# EAGLE design PingPong_388_2019 rev2 (EAGLE 9.5.1)
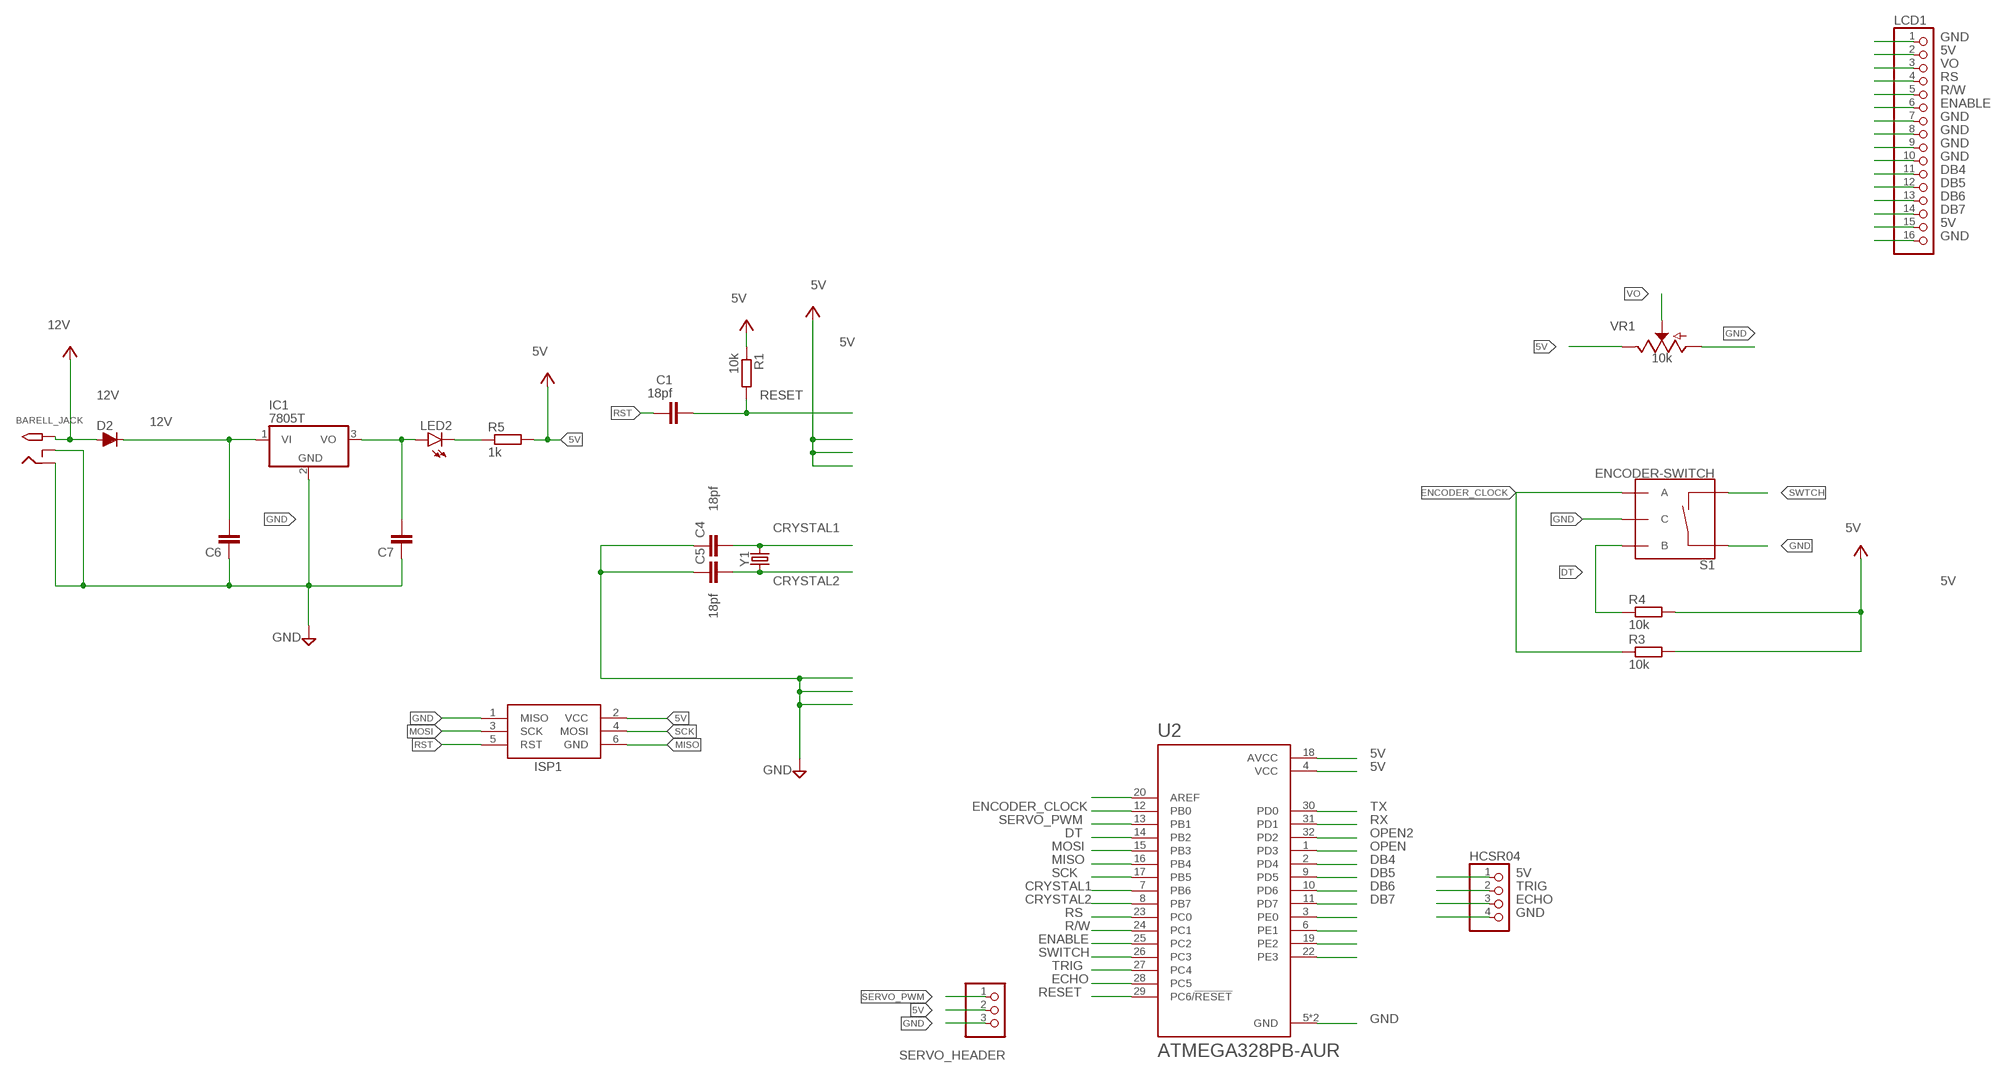
[diagram p0: schematic, sheet 1]

## Parts
BARELL_JACK  2.1MMJACKTHM  [PJ-102A]
C1  18pf  C-EUC0805  [C0805]
C4  18pf  C-EUC0805  [C0805]
C5  18pf  C-EUC0805  [C0805]
C6  C-EUC0805  [C0805]
C7  C-EUC0805  [C0805]
D2  D-FILL-MLL-34  [MELF-MLL34]
HCSR04  PINHD-1X4  [1X04]
IC1  7805T  [TO220H]
ISP1  AVRISP-6  [AVRISP]
LCD1  PINHD-1X16  [1X16]
LED2  LED  [SMARTLED-TTW]
R1  10k  R-EU_R0805  [R0805]
R3  10k  R-EU_R0805  [R0805]
R4  10k  R-EU_R0805  [R0805]
R5  1k  R-EU_R0805  [R0805]
S1  ENCODER-SWITCH  [ROTARY_ENC_PLAIN]
SERVO_HEADER  PINHD-1X3  [1X03]
U2  ATMEGA328PB-AUR  [QFP80P900X900X120-32N]
VR1  10k  POTENTIOMETER-PTH-9MM-1/20W-20%  [POT-PTH-ALPS]
Y1  CRYSTALSMD-HC49UP  [HC49UP]

## Nets
5V: C7.2 HCSR04.1 IC1.3(VO) ISP1.2(VCC) LCD1.2 LCD1.15 LED2.A@1(A) R3.2 R4.2 R5.2 SERVO_HEADER.2 U2.4(VCC) U2.18(AVCC) VR1.P$1(E)
12V: BARELL_JACK.TIP C6.2 D2.1(C) D2.2(A) IC1.1(VI)
CRYSTAL1: C4.2 U2.7(PB6) Y1.2
CRYSTAL2: C5.2 U2.8(PB7) Y1.1
DB4: LCD1.11 U2.2(PD4)
DB5: LCD1.12 U2.9(PD5)
DB6: LCD1.13 U2.10(PD6)
DB7: LCD1.14 U2.11(PD7)
DT: R4.1 S1.B U2.14(PB2)
ECHO: HCSR04.3 U2.28(PC5)
ENABLE: LCD1.6 U2.25(PC2)
ENCODER_CLOCK: R3.1 S1.A U2.12(PB0)
GND: BARELL_JACK.RING BARELL_JACK.RING_SW C4.1 C5.1 C6.1 C7.1 HCSR04.4 IC1.2(GND) ISP1.1(MISO) LCD1.1 LCD1.7 LCD1.8 LCD1.9 LCD1.10 LCD1.16 S1.C S1.SW+ SERVO_HEADER.3 U2.5(GND) U2.21(GND) VR1.P$3(A)
MISO: ISP1.6(GND) U2.16(PB4)
MOSI: ISP1.3(SCK) U2.15(PB3)
N$3: LED2.C@1(C) R5.1
N$14: U2.3(PE0)
N$15: U2.6(PE1)
N$16: U2.19(PE2)
N$17: U2.22(PE3)
N$18: U2.20(AREF)
OPEN: U2.1(PD3)
OPEN2: U2.32(PD2)
R/W: LCD1.5 U2.24(PC1)
RESET: C1.2 R1.2 U2.29(PC6/!RESET)
RS: LCD1.4 U2.23(PC0)
RST: C1.1 ISP1.5(RST)
RX: U2.31(PD1)
SCK: ISP1.4(MOSI) U2.17(PB5)
SERVO_PWM: SERVO_HEADER.1 U2.13(PB1)
SWITCH: U2.26(PC3)
SWTCH: S1.SW-
TRIG: HCSR04.2 U2.27(PC4)
TX: U2.30(PD0)
VCC: R1.1 ; supply symbol labelled 5V
VO: LCD1.3 VR1.P$2(S)

## Library data of the parts
BARELL_JACK = ECE388:2.1MMJACK: 2.1mm x 5.5mm THM DC jack with internal switch. Digikey part #PJ-102A, 4UCON part #05537 2.1mm x 5.5mm SMT DC jack with internal switch. Digikey part #PJ-002A-SMT, 4UCON part #03267 By microbuilder.eu & adafruit.com
C1 C4-C7 = rcl:C-EU: CAPACITOR, European symbol; SPICEPREFIX: C
D2 = semicon-smd-ipc:D-FILL-: DIODE filled
HCSR04 = pinhead:PINHD-1X4: PIN HEADER
IC1 = ECE388:78*: Positive VOLTAGE REGULATOR Added bigger pads to the TO-92 package
ISP1 = ECE388:AVRISP: AVR ISP HEADER Standard 6 pin header for AVR programming
LCD1 = pinhead:PINHD-1X16: PIN HEADER
LED2 = led:LED: LED OSRAM: - CHIPLED LG R971, LG N971, LY N971, LG Q971, LY Q971, LO R971, LY R971 LH N974, LH R974 LS Q976, LO Q976, LY Q976 LO Q996 - Hyper CHIPLED LW Q18S LB Q993, LB Q99A, LB R99A - SideLED LS A670, LO A670, LY A670, LG A670, LP A670 LB A673, LV A673, LT A673, LW A673 LH A674 LY A675 LS A676, LA A676, LO A676, LY A676, LW A676 LS A679, LY A679, LG A679 - Hyper Micro SIDELED® LS Y876, LA Y876, LO Y876, LY Y876 LT Y87S - SmartLED LW L88C, LW L88S LB L89C, LB L89S, LG L890 LS L89K, LO L89K, LY L89K LS L896, LA L896, LO L896, LY L896 - TOPLED LS T670, LO T670, LY T670, LG T670, LP T670 LSG T670, LSP T670, LSY T670, LOP T670, LYG T670 LG T671, LOG T671, LSG T671 LB T673, LV T673, LT T673, LW T673 LH T674 LS T676, LA T676, LO T676, LY T676, LB T676, LH T676, LSB T676, LW T676 LB T67C, LV T67C, LT T67C, LS T67K, LO T67K, LY T67K, LW E67C LS E67B, LA E67B, LO E67B, LY E67B, LB E67C, LV E67C, LT E67C LW T67C LS T679, LY T679, LG T679 LS T770, LO T770, LY T770, LG T770, LP T770 LB T773, LV T773, LT T773, LW T773 LH T774 LS E675, LA E675, LY E675, LS T675 LS T776, LA T776, LO T776, LY T776, LB T776 LHGB T686 LT T68C, LB T68C - Hyper Mini TOPLED® LB M676 - Mini TOPLED Santana® LG M470 LS M47K, LO M47K, LY M47K Source: http://www.osram.convergy.de LUXEON: - LUMILED® LXK2-PW12-R00, LXK2-PW12-S00, LXK2-PW14-U00, LXK2-PW14-V00 LXK2-PM12-R00, LXK2-PM12-S00, LXK2-PM14-U00 LXK2-PE12-Q00, LXK2-PE12-R00, LXK2-PE12-S00, LXK2-PE14-T00, LXK2-PE14-U00 LXK2-PB12-K00, LXK2-PB12-L00, LXK2-PB12-M00, LXK2-PB14-N00, LXK2-PB14-P00, LXK2-PB14-Q00 LXK2-PR12-L00, LXK2-PR12-M00, LXK2-PR14-Q00, LXK2-PR14-R00 LXK2-PD12-Q00, LXK2-PD12-R00, LXK2-PD12-S00 LXK2-PH12-R00, LXK2-PH12-S00 LXK2-PL12-P00, LXK2-PL12-Q00, LXK2-PL12-R00 Source: www.luxeon.com KINGBRIGHT: KA-3528ASYC Source: www.kingbright.com
R1 R3-R5 = rcl:R-EU_: RESISTOR, European symbol; SPICEPREFIX: R
S1 = SparkFun-Switches:ENCODER-SWITCH: Rotary Encoder w/ Select Switch Encoders rotate similarly to potentiometers, but they’re different from potentiometers in that an encoder has full rotation without limits. They output gray code so that you can tell how much and in which direction the encoder has been turned. This encoder includes a push-down select switch built into the shaft. SparkFun Products Rotary Encoder <https://www.sparkfun.com/products/9117> (COM-09117); SF_SKU: COM-09117
SERVO_HEADER = pinhead:PINHD-1X3: PIN HEADER
U2 = ATMEGA328PB-AUR:ATMEGA328PB-AUR: ATmega Series 20 MHz 32 KB Flash 2 KB SRAM 8-Bit Microcontroller - TQFP-32; AVAILABILITY: Unavailable; DESCRIPTION: AVR microcontroller; EEPROM: 1024B; SRAM: 2kB; Flash: 32kB; TQFP32; MF: Microchip; MP: ATMEGA328PB-AUR; PACKAGE: TQFP-32 Microchip; PRICE: None
VR1 = SparkFun-Resistors:POTENTIOMETER: Potentiometer (Pot) Three-terminal potentiometers, with an adjustable wiper and two adjustable resistors. A pot can be used to create a configurable voltage divider, or as a variable resistor. Variants ALPS_POT and ALPS_POT_KIT - PTH, breadboard compatible, 9mm square pots Rotary Potentiometer - Linear (10k ohm) <https://www.sparkfun.com/products/9288> (COM-09288) The KIT variant exposes copper on only one side of the PTH pad, so the part can only be assembled on one side of the PCB. Useful for beginner soldering kits.; PROD_ID: RES-09177; SF_SKU: COM-09288
Y1 = SparkFun-Clocks:CRYSTAL: Crystals (Generic) These are passive quartz crystals, which can be used as a clock source for a microcontroller. Crystal's are two-terminal devices. They require external "load" capacitors to generate an oscillating signal.

## Net classes
0 default: width 0.203 mm, drill 0.381 mm, clearance 0.203 mm

## Board
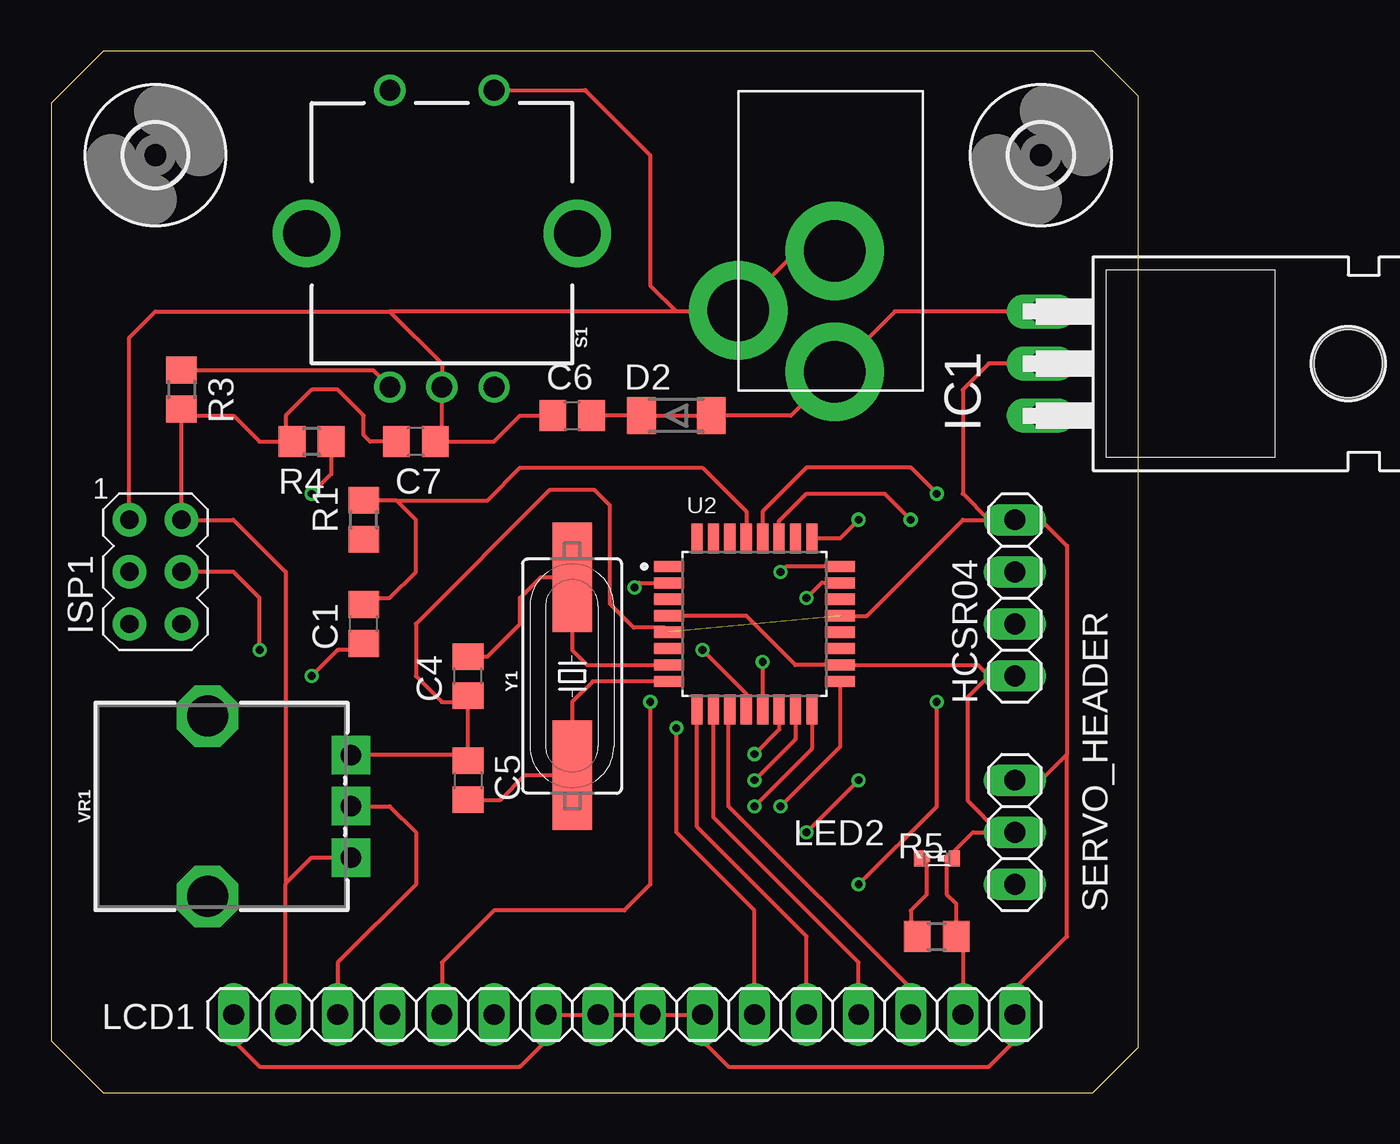
[diagram p1: board, top side]
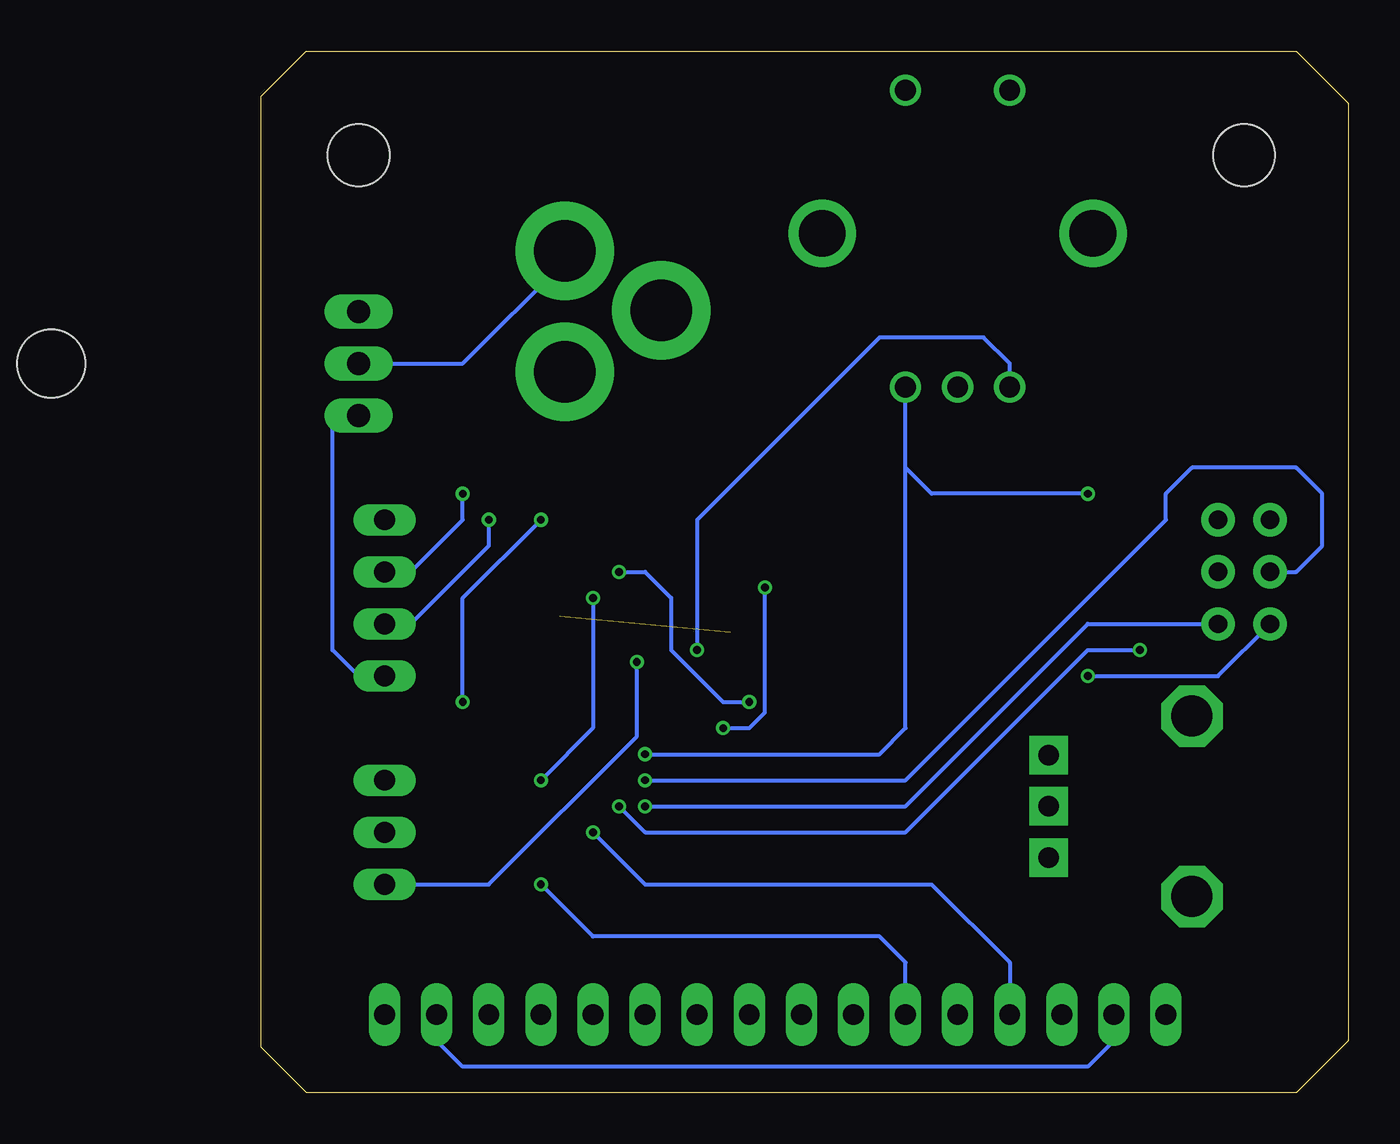
[diagram p2: board, bottom side, seen from below]

Size 53.01 x 50.79 mm. Coordinates in mm from the lower left corner, seen from the top.
Outline: 50.81,50.79 2.53,50.79 0,48.26 0,2.54 2.54,0 50.8,0 53.01,2.21 53.01,48.59 50.81,50.79
Copper layers (1*16): Top 0.035mm / dielectric 1.5mm / Bottom 0.035mm
Design rules "Dirty8TS": minimum track width 8mil, minimum drill 15mil, track to track 8mil, track to pad 8mil, pad to pad 8mil, via to via 8mil, smd to smd 0mil, copper to edge 10mil, drill to drill 10mil, minimum pad ring 10mil, minimum via ring 6mil, stop-mask expansion 2mil, vias tented up to drill 25mil, thermal gap 10mil

### Footprints (pad centres in the part's own frame; a part is rotated, then mirrored left to right if it is on the bottom)
PJ-102A = drill 3 pad 4.8: RING 0.1,-3.39; RING_SW -4.6,-6.29; TIP 0.1,-9.29
C0805 = smd 1.3 x 1.5: 1 -0.95,0; 2 0.95,0
MELF-MLL34 = smd 1.4 x 1.8: 1 -1.7,0; 2 1.7,0
1X04 = drill 1.016 long: 1 -3.81,0; 2 -1.27,0; 3 1.27,0; 4 3.81,0
TO220H = drill 1.118 long: 1 -2.54,-10.16; 2 0,-10.16; 3 2.54,-10.16 | hole 3.302: 0,4.826
AVRISP = drill 0.9 pad 1.626: 1 -1.27,2.54; 2 1.27,2.54; 3 -1.27,0; 4 1.27,0; 5 -1.27,-2.54; 6 1.27,-2.54
1X16 = drill 1.016 long: 1 -19.05,0; 2 -16.51,0; 3 -13.97,0; 4 -11.43,0; 5 -8.89,0; 6 -6.35,0; 7 -3.81,0; 8 -1.27,0; 9 1.27,0; 10 3.81,0; 11 6.35,0; 12 8.89,0; 13 11.43,0; 14 13.97,0; 15 16.51,0; 16 19.05,0
SMARTLED-TTW = smd 0.8 x 0.5: A 0,-0.875; C 0,0.875 | smd 0.35 x 0.35: A@1 0,-0.5; C@1 0,0.5
R0805 = smd 1.3 x 1.5: 1 -0.95,0; 2 0.95,0
ROTARY_ENC_PLAIN = drill 1.016: A 7.493,-2.54; B 7.493,2.54; C 7.493,0; SW+ -6.985,2.54; SW- -6.985,-2.54 | drill 2.286: P$3 0,6.604; P$4 0,-6.604
1X03 = drill 1.016 long: 1 -2.54,0; 2 0,0; 3 2.54,0
QFP80P900X900X120-32N = smd 1.47 x 0.55: 1 -4.17,2.8; 2 -4.17,2; 3 -4.17,1.2; 4 -4.17,0.4; 5 -4.17,-0.4; 6 -4.17,-1.2; 7 -4.17,-2; 8 -4.17,-2.8; 17 4.17,-2.8; 18 4.17,-2; 19 4.17,-1.2; 20 4.17,-0.4; 21 4.17,0.4; 22 4.17,1.2; 23 4.17,2; 24 4.17,2.8 | smd 0.55 x 1.47: 9 -2.8,-4.17; 10 -2,-4.17; 11 -1.2,-4.17; 12 -0.4,-4.17; 13 0.4,-4.17; 14 1.2,-4.17; 15 2,-4.17; 16 2.8,-4.17; 25 2.8,4.17; 26 2,4.17; 27 1.2,4.17; 28 0.4,4.17; 29 -0.4,4.17; 30 -1.2,4.17; 31 -2,4.17; 32 -2.8,4.17
3,0 = hole 3: 0,0
POT-PTH-ALPS = drill 1 pad 1.88 square: P$1 7,-2.5; P$2 7,0; P$3 7,2.5 | drill 2 octagon: P$4 0,-4.4; P$5 0,4.4
HC49UP = smd 5.334 x 1.93: 1 -4.826,0; 2 4.826,0

### Placement (x,y rotation side)
BARELL_JACK  38.1,44.45 0 top
C1  15.24,22.86 90 top
C4  20.32,20.32 90 top
C5  20.32,15.24 270 top
C6  25.4,33.02 0 top
C7  17.78,31.75 180 top
D2  30.48,33.02 0 top
HCSR04  46.99,24.13 90 top
IC1  58.42,35.56 270 top
ISP1  5.08,25.4 0 top
LCD1  27.94,3.81 0 top
LED2  43.18,11.43 90 top
R1  15.24,27.94 90 top
R3  6.35,34.29 270 top
R4  12.7,31.75 180 top
R5  43.18,7.62 0 top
S1  19.05,41.91 270 top
SERVO_HEADER  46.99,12.7 90 top
U2  34.29,22.86 0 top
U$1  [3,0]  5.08,45.72 0 top
U$2  [3,0]  48.26,45.72 0 top
VR1  7.62,13.97 0 top
Y1  25.4,20.32 90 top

### Tracks (layer width: path | path; a pad name or v marks a point on that pad's centre or on a via)
5V
  Top 0.203: 46.22,12.7 SERVO_HEADER.2 | HCSR04.1 45.72,20.32 | 45.72,20.32 45.18,20.86 U2.18 36.29,20.86 33.89,23.26 U2.4 | VR1.P$1 12.7,11.47 11.43,10.2 | LCD1.2 11.43,10.2 | 46.22,12.7 44.7,14.22 44.7,19.3 45.72,20.32 | 11.43,31.75 10.16,31.75 8.89,33.02 6.67,33.02 R3.2 ISP1.2 8.89,27.94 11.43,25.4 11.43,10.2 | 46.22,12.7 44.95,12.7 LED2.A@1 43.68,9.66 44.13,9.21 R5.2 | C7.2 15.56,31.75 15.24,32.07 15.24,33.02 13.97,34.29 12.7,34.29 11.43,33.02 11.43,31.75 | R5.2 44.45,7.3 LCD1.15 | R5.2 44.29,7.78 | R4.2 11.43,31.75
  Bottom 0.203: HCSR04.1 48.26,20.32 49.53,21.59 49.53,33.02 IC1.3 | LCD1.2 11.43,2.54 12.7,1.27 43.18,1.27 44.45,2.54 LCD1.15
12V
  Top 0.203: IC1.1 41.14,38.1 BARELL_JACK.TIP 36.06,33.02 D2.2 D2.1 C6.2
CRYSTAL1
  Top 0.203: C4.2 21.27,21.27 22.86,22.86 22.86,24.13 23.88,25.15 Y1.2 25.4,21.59 26.13,20.86 U2.7
CRYSTAL2
  Top 0.203: U2.8 26.41,20.06 25.4,19.05 Y1.1 | C5.2 21.91,14.29 23.11,15.49 Y1.1 | Y1.1 25.4,14.61 25.08,14.29
DB4  (via drill 0.38)
  Top 0.203: LCD1.11 34.29,8.89 30.48,12.7 v30.48,17.78 | v28.45,24.64 28.67,24.86 U2.2
  Bottom 0.203: v30.48,17.78 29.21,17.78 28.45,18.54 v28.45,24.64
DB5
  Top 0.203: LCD1.12 36.83,7.62 31.49,12.96 U2.9
DB6
  Top 0.203: LCD1.13 39.37,6.35 32.29,13.43 U2.10
DB7
  Top 0.203: LCD1.14 41.91,5.08 33.02,13.97 33.02,18.62 U2.11
DT  (via drill 0.38)
  Top 0.203: U2.14 35.49,17.71 v34.29,16.51 | R4.1 13.65,30.16 v12.7,29.21
  Bottom 0.203: v34.29,16.51 22.86,16.51 21.59,17.78 21.59,30.48 | 21.59,30.48 S1.B | v12.7,29.21 20.32,29.21 21.59,30.48
ECHO  (via drill 0.38)
  Top 0.203: v43.18,29.21 41.91,30.48 36.83,30.48 34.69,28.34 U2.28
  Bottom 0.203: HCSR04.3 45.72,25.4 43.18,27.94 v43.18,29.21
ENABLE  (via drill 0.38)
  Top 0.203: v39.37,10.16 43.18,13.97 v43.18,19.05 | v39.37,27.94 38.46,27.03 U2.25
  Bottom 0.203: LCD1.6 21.59,6.35 22.86,7.62 36.83,7.62 v39.37,10.16 | v39.37,27.94 43.18,24.13 v43.18,19.05
ENCODER_CLOCK  (via drill 0.38)
  Top 0.203: v31.75,21.59 33.89,19.45 U2.12 | S1.A 15.69,35.24 R3.1
  Bottom 0.203: S1.A 16.51,35.56 17.78,36.83 22.86,36.83 31.75,27.94 v31.75,21.59
GND  (1 unrouted)
  Top 0.203: C5.1 20.32,16.51 | 20.32,16.51 20.32,19.05 | 20.32,19.05 C4.1 | LCD1.1 8.89,2.54 10.16,1.27 22.86,1.27 24.13,2.54 LCD1.7 LCD1.8 LCD1.9 LCD1.10 31.75,2.54 33.02,1.27 45.72,1.27 46.99,2.54 LCD1.16 46.99,5.08 49.53,7.62 49.53,16.51 | U2.21 39.77,23.26 44.45,27.94 45.72,27.94 | 45.72,27.94 HCSR04.4 48.26,27.94 49.53,26.67 49.53,16.51 | SERVO_HEADER.3 48.26,15.24 49.53,16.51 | VR1.P$3 14.66,16.51 20.32,16.51 | BARELL_JACK.RING 36.4,41.06 BARELL_JACK.RING_SW 33.44,38.1 30.48,38.1 | S1.SW+ 26.04,48.9 29.21,45.72 29.21,39.37 30.48,38.1 | ISP1.1 3.81,36.83 5.08,38.1 16.51,38.1 | 16.51,38.1 19.05,35.56 S1.C 19.05,32.07 C7.1 21.59,31.75 22.86,33.02 C6.1 | U2.5 29.9,22.68 28.4,22.68 27.24,23.84 27.24,28.64 26.49,29.39 24.31,29.39 17.78,22.86 17.78,20.32 19.05,19.05 20.32,19.05 | IC1.2 45.72,35.56 44.45,34.29 44.45,29.21 45.72,27.94 | 30.48,38.1 16.51,38.1
  Bottom 0.203: IC1.2 43.18,35.56 38.2,40.54 BARELL_JACK.RING
MISO  (via drill 0.38)
  Top 0.203: U2.16 37.09,16.77 v34.29,13.97
  Bottom 0.203: v34.29,13.97 21.59,13.97 12.7,22.86 ISP1.6
MOSI  (via drill 0.38)
  Top 0.203: U2.15 36.29,17.24 v34.29,15.24
  Bottom 0.203: v34.29,15.24 21.59,15.24 8.89,27.94 8.89,29.21 7.62,30.48 2.54,30.48 1.27,29.21 1.27,26.67 2.54,25.4 ISP1.3
N$3
  Top 0.203: R5.1 41.91,7.94 41.91,8.89 42.68,9.66 LED2.C@1
R/W  (via drill 0.38)
  Top 0.203: U2.24 35.82,25.66 v35.56,25.4 | v29.21,19.05 29.21,10.16 27.94,8.89 21.59,8.89 19.05,6.35 LCD1.5
  Bottom 0.203: v35.56,25.4 34.29,25.4 33.02,24.13 33.02,21.59 30.48,19.05 v29.21,19.05
RESET
  Top 0.203: C1.2 15.56,24.13 16.51,24.13 17.78,25.4 17.78,27.94 16.83,28.89 | 16.83,28.89 16.51,28.89 R1.2 | U2.29 33.89,28.34 31.75,30.48 22.86,30.48 21.27,28.89 16.83,28.89
RS  (via drill 0.38)
  Top 0.203: U2.23 37.56,24.86 v36.83,24.13 | v39.37,15.24 v36.83,12.7
  Bottom 0.203: v39.37,15.24 36.83,17.78 v36.83,24.13 | v36.83,12.7 34.29,10.16 20.32,10.16 16.51,6.35 LCD1.4
RST  (via drill 0.38)
  Top 0.203: C1.1 14.92,21.59 13.97,21.59 v12.7,20.32
  Bottom 0.203: ISP1.5 6.35,20.32 v12.7,20.32
SCK  (via drill 0.38)
  Top 0.203: U2.17 38.46,16.87 v35.56,13.97 | v10.16,21.59 10.16,24.13 8.89,25.4 ISP1.4
  Bottom 0.203: v35.56,13.97 34.29,12.7 21.59,12.7 12.7,21.59 v10.16,21.59
SERVO_PWM  (via drill 0.38)
  Top 0.203: v34.69,21.01 U2.13
  Bottom 0.203: SERVO_HEADER.1 41.91,10.16 34.69,17.38 v34.69,21.01
TRIG  (via drill 0.38)
  Top 0.203: U2.27 35.49,27.87 36.83,29.21 40.64,29.21 v41.91,27.94
  Bottom 0.203: v41.91,27.94 41.91,26.67 45.72,22.86 HCSR04.2
VO
  Top 0.203: VR1.P$2 16.51,13.97 17.78,12.7 17.78,10.16 13.97,6.35 LCD1.3